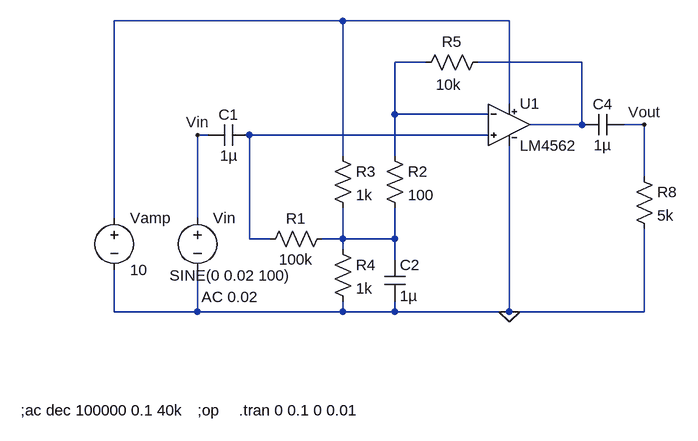
[diagram p0: schematic Normalization_test.asc]
Normalization_test.asc, the LTspice schematic file:
Version 4
SHEET 1 880 760
WIRE 32 144 -320 144
WIRE 288 144 32 144
WIRE 160 208 112 208
WIRE 400 208 240 208
WIRE 288 272 288 144
WIRE 112 288 112 208
WIRE 256 288 112 288
WIRE 400 304 400 208
WIRE 400 304 320 304
WIRE 496 304 464 304
WIRE -176 320 -192 320
WIRE 256 320 -112 320
WIRE 32 352 32 144
WIRE 112 352 112 288
WIRE 496 384 496 304
WIRE -320 448 -320 144
WIRE -192 448 -192 320
WIRE -112 480 -112 320
WIRE -80 480 -112 480
WIRE 32 480 32 432
WIRE 32 480 0 480
WIRE 112 480 112 432
WIRE 112 480 32 480
WIRE 32 496 32 480
WIRE 112 512 112 480
WIRE -320 592 -320 528
WIRE -192 592 -192 528
WIRE -192 592 -320 592
WIRE 32 592 32 576
WIRE 32 592 -192 592
WIRE 112 592 112 576
WIRE 112 592 32 592
WIRE 288 592 288 336
WIRE 288 592 112 592
WIRE 496 592 496 464
WIRE 496 592 288 592
FLAG 496 304 Vout
FLAG -192 320 Vin
FLAG 288 592 0
SYMBOL NewOpamps\\LM4562 288 240 R0
SYMATTR InstName U1
SYMBOL Overige\ componenten\\voltage -192 432 R0
WINDOW 123 6 137 Left 2
WINDOW 39 0 0 Left 2
WINDOW 3 -43 104 Left 2
SYMATTR Value2 AC 0.02
SYMATTR InstName Vin
SYMATTR Value SINE(0 0.02 100)
SYMBOL res -96 496 R270
WINDOW 0 32 56 VTop 2
WINDOW 3 0 56 VBottom 2
SYMATTR InstName R1
SYMATTR Value 100k
SYMBOL cap -176 336 R270
WINDOW 0 32 32 VTop 2
WINDOW 3 0 32 VBottom 2
SYMATTR InstName C1
SYMATTR Value 1µ
SYMBOL res 16 336 R0
SYMATTR InstName R3
SYMATTR Value 1k
SYMBOL cap 96 512 R0
SYMATTR InstName C2
SYMATTR Value 1µ
SYMBOL Overige\ componenten\\voltage -320 432 R0
WINDOW 123 0 0 Left 2
WINDOW 39 0 0 Left 2
SYMATTR InstName Vamp
SYMATTR Value 10
SYMBOL res 96 336 R0
SYMATTR InstName R2
SYMATTR Value 100
SYMBOL res 144 224 R270
WINDOW 0 32 56 VTop 2
WINDOW 3 -3 51 VBottom 2
SYMATTR InstName R5
SYMATTR Value 10k
SYMBOL res 16 480 R0
SYMATTR InstName R4
SYMATTR Value 1k
SYMBOL cap 400 320 R270
WINDOW 0 32 32 VTop 2
WINDOW 3 0 32 VBottom 2
SYMATTR InstName C4
SYMATTR Value 1µ
SYMATTR SpiceLine Rser=0.1
SYMBOL res 480 368 R0
SYMATTR InstName R8
SYMATTR Value 5k
TEXT -192 744 Left 2 !;op
TEXT -128 744 Left 2 !.tran 0 0.1 0 0.01
TEXT -464 744 Left 2 !;ac dec 100000 0.1 40k

The netlist it stands for:
* Normalization_test.asc
XU1 N004 N002 N001 0 N003 LM4562  ; pins In+ In- V+ V- OUT
Vin Vin 0 SINE(0 0.02 100) AC 0.02
R1 N004 N005 100k
C1 Vin N004 1µ
R3 N001 N005 1k
C2 N005 0 1µ
Vamp N001 0 10
R2 N002 N005 100
R5 N002 N003 10k
R4 N005 0 1k
C4 N003 Vout 1µ Rser=0.1
R8 Vout 0 5k
;op
.tran 0 0.1 0 0.01
;ac dec 100000 0.1 40k
.lib NewOpamps\LM4562.lib
.backanno
.end